# EAGLE schematic DF32-revision-Brouted (EAGLE 6.6.0)
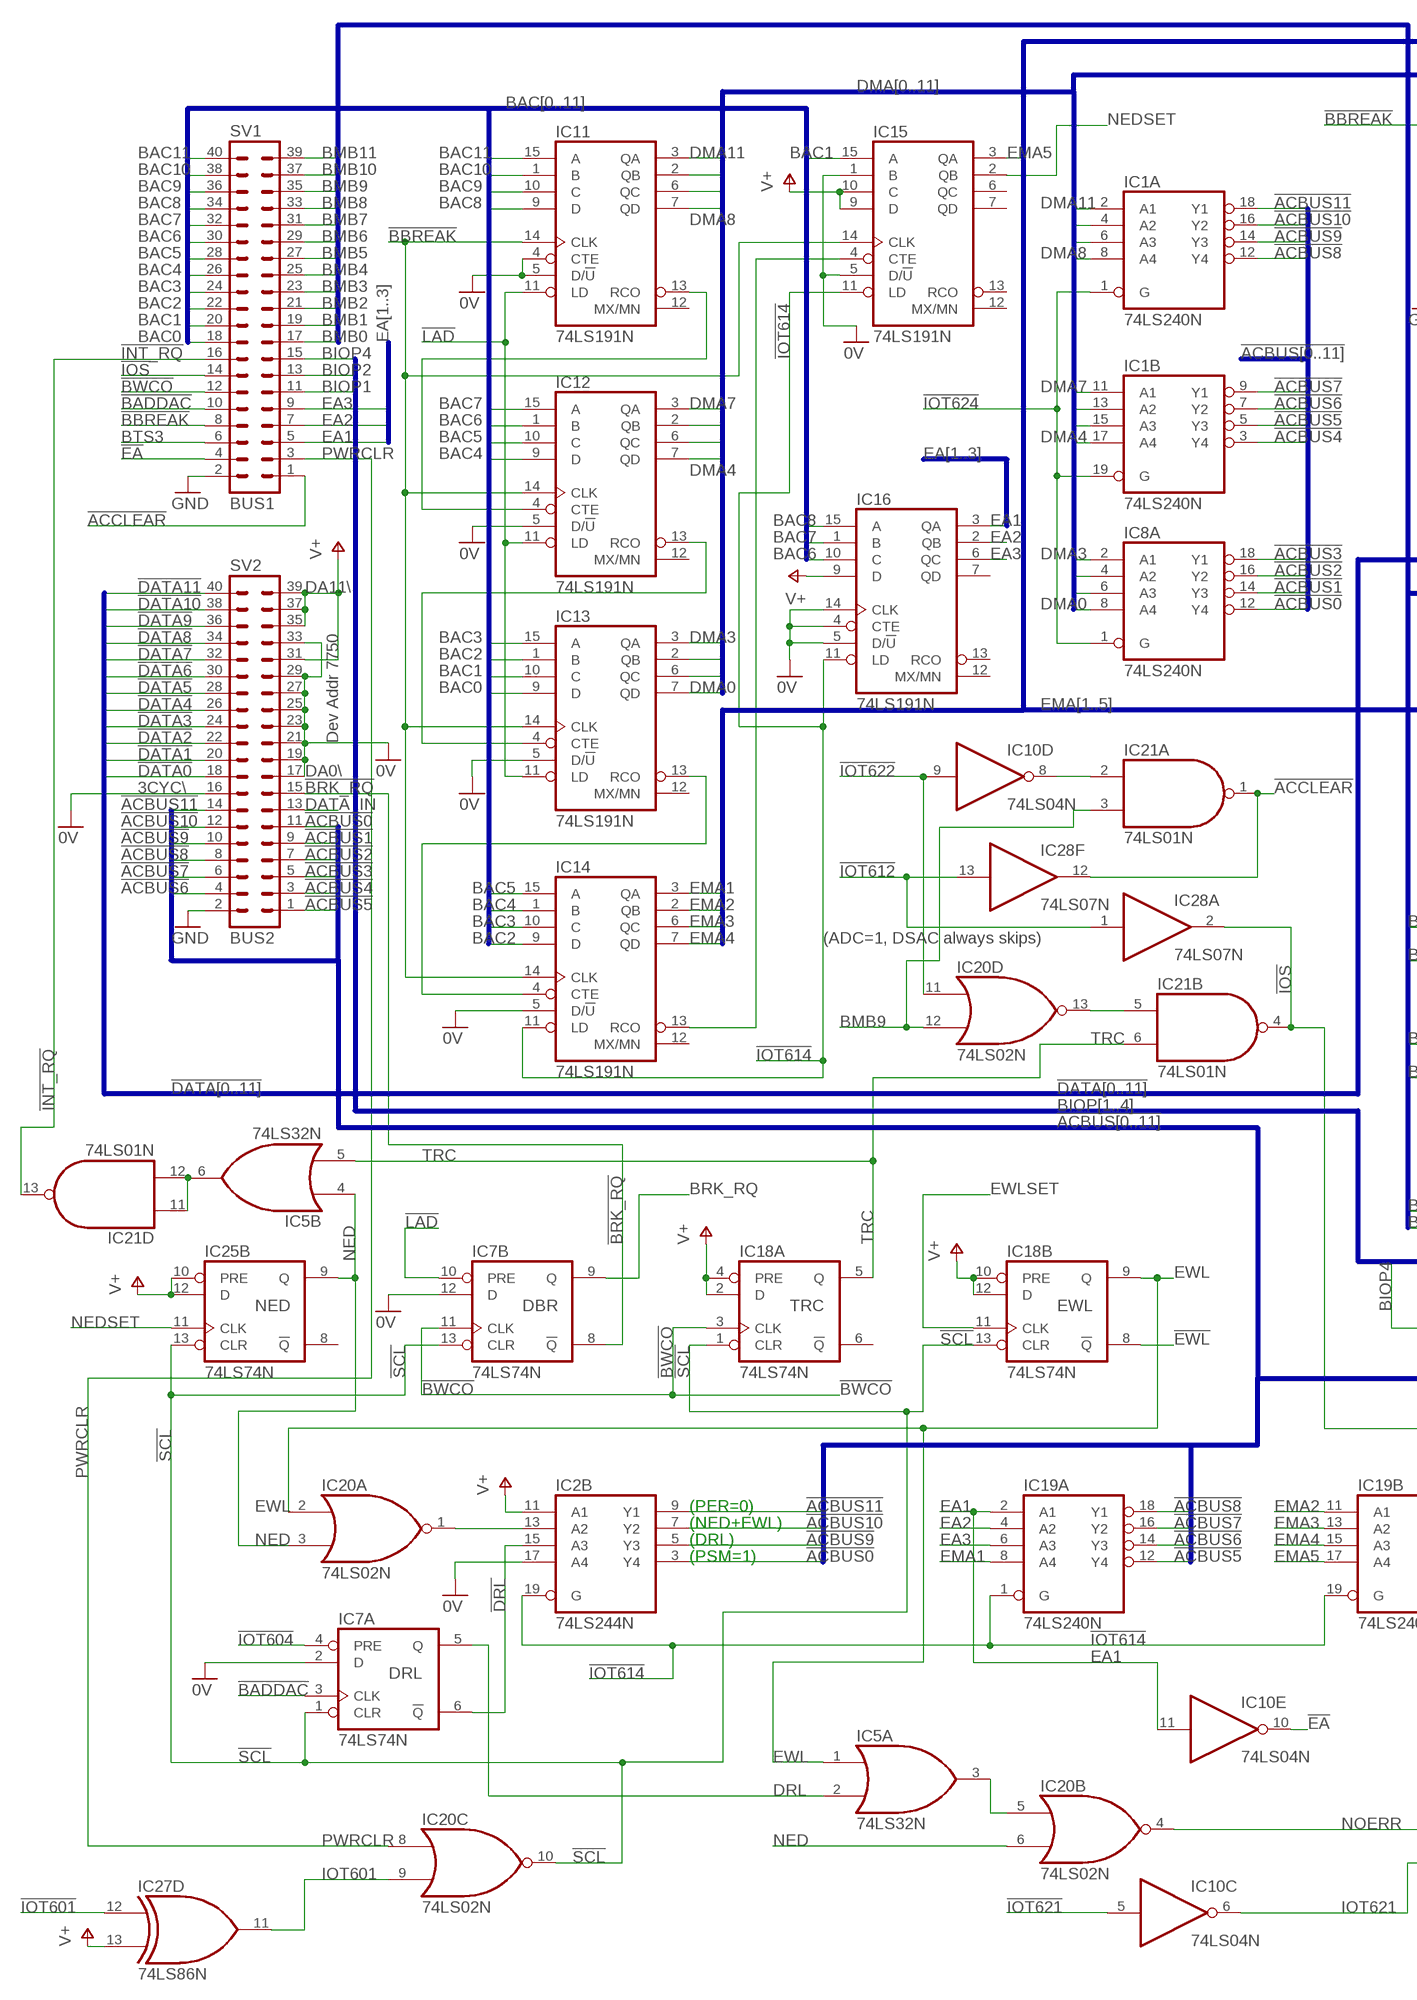
[diagram p0: schematic, sheet 1, part 1 of 2]
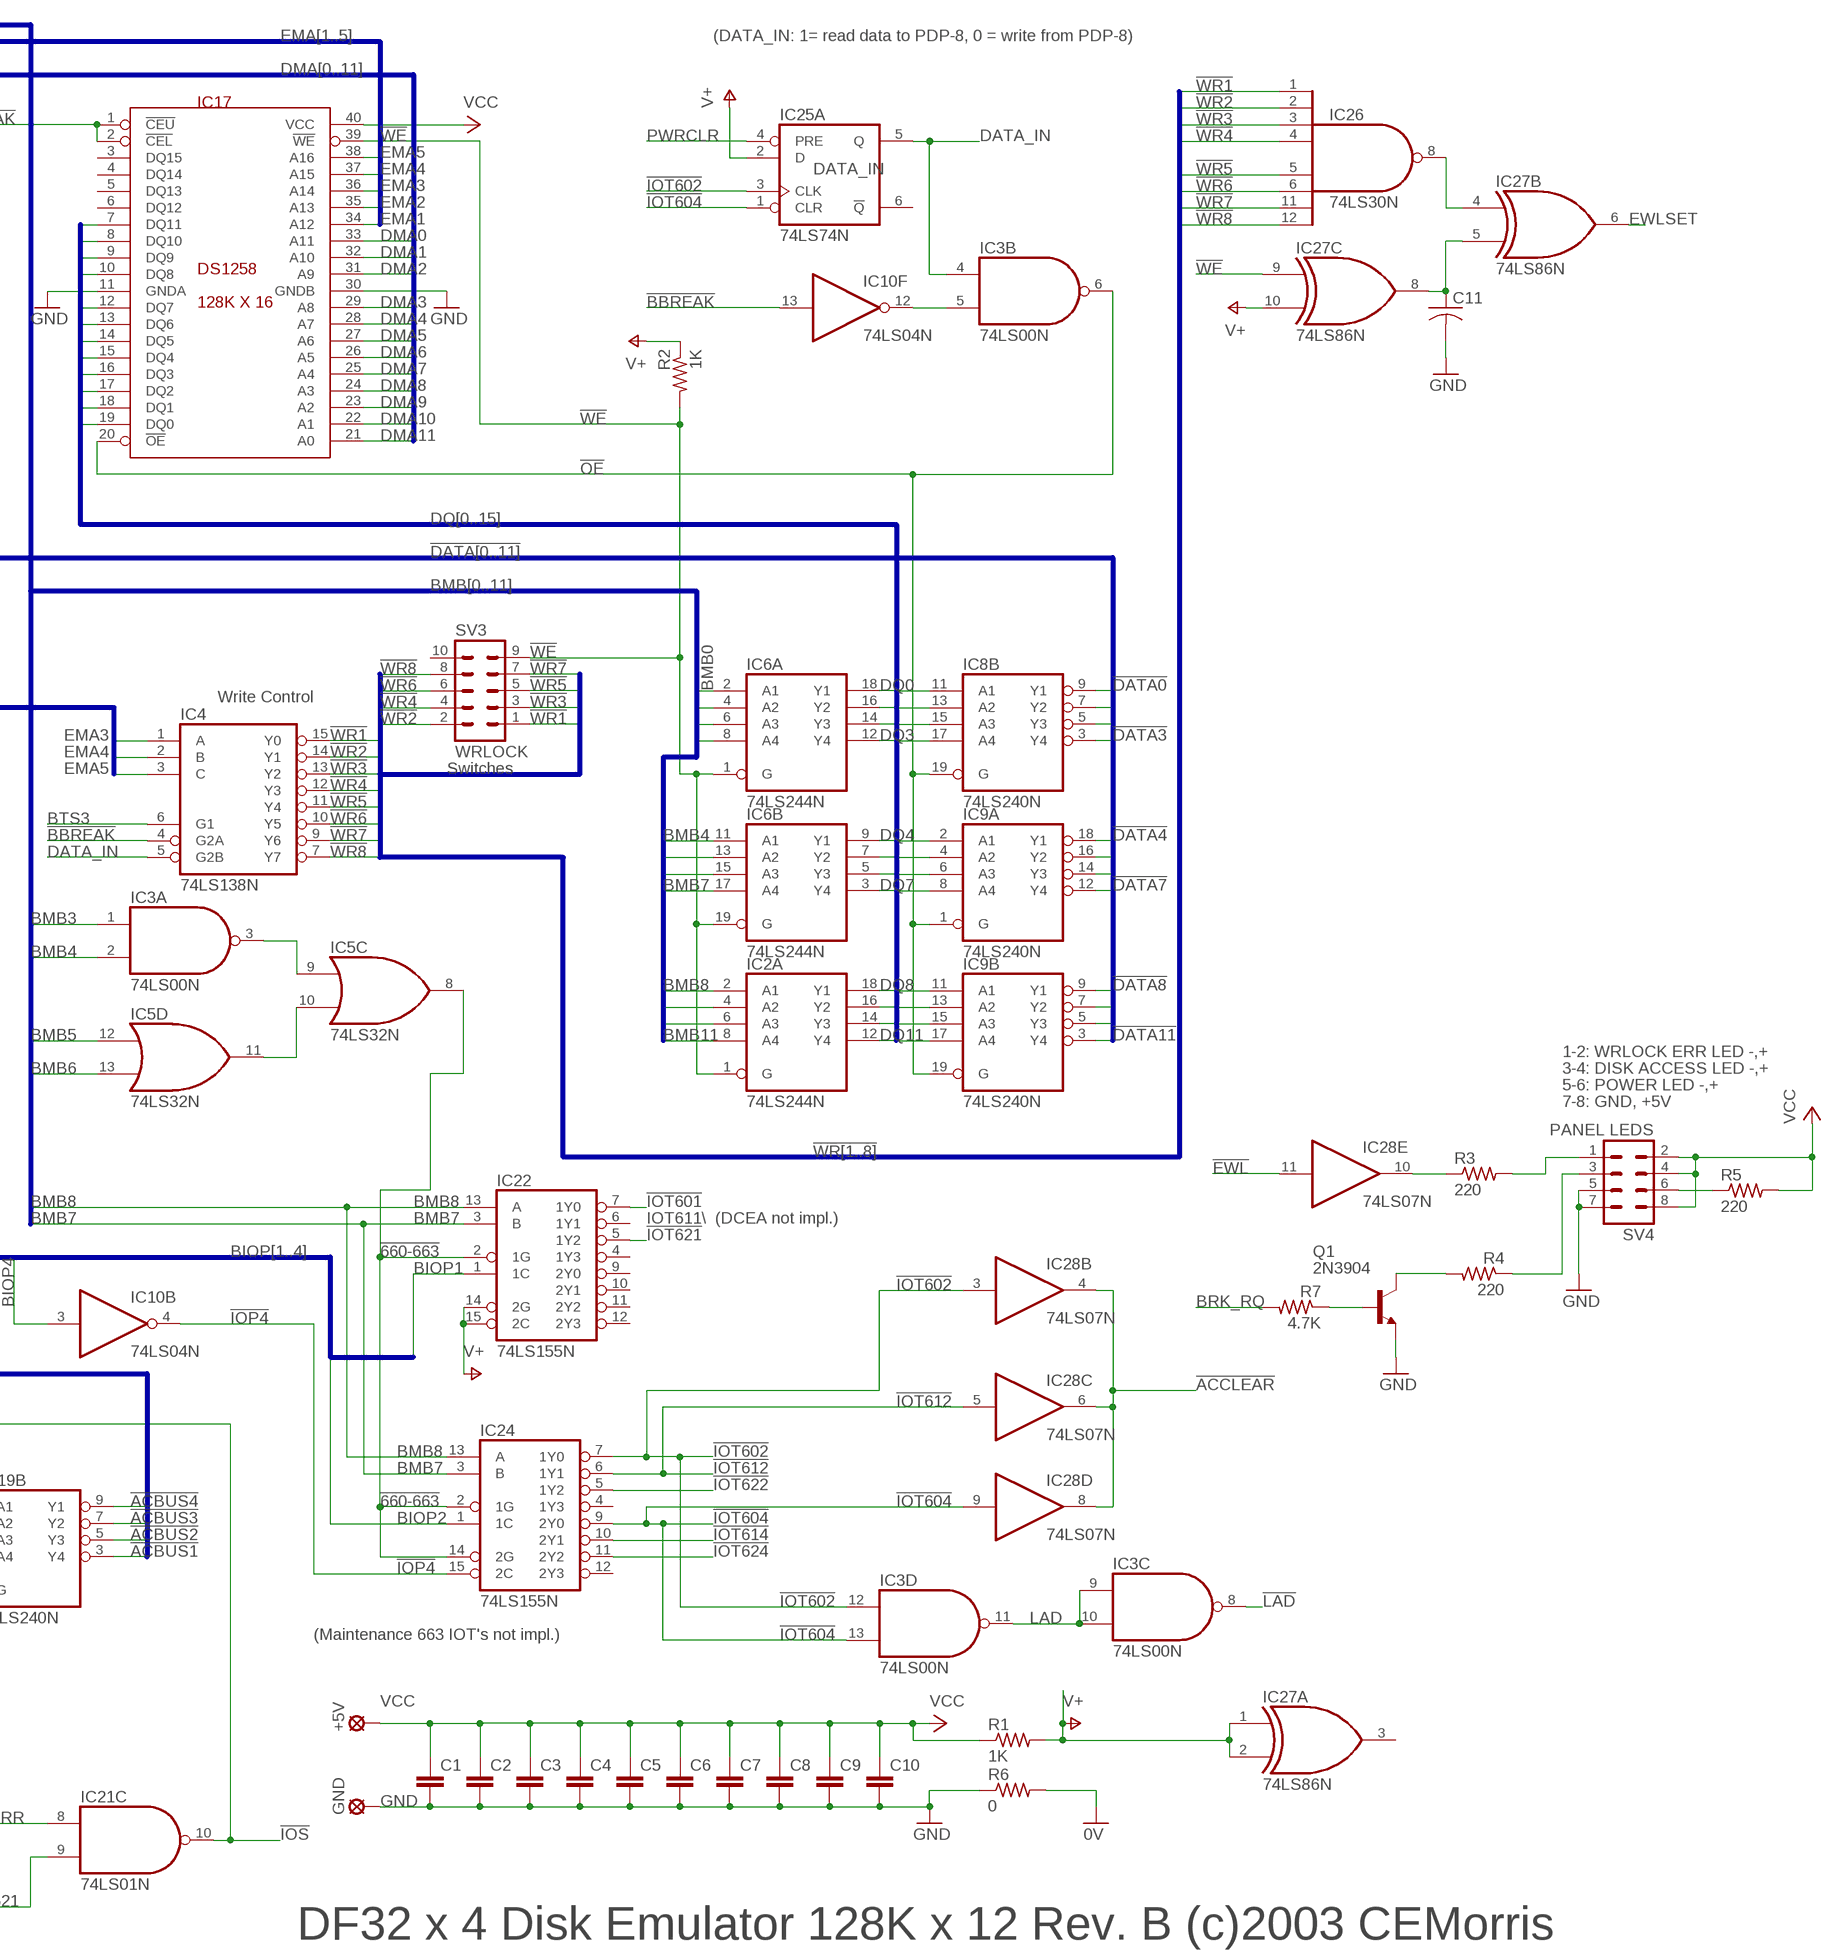
[diagram p1: schematic, sheet 1, part 2 of 2]

## Parts
+5V  SE14  [SE14]
C1  C5/3.5  [C5B3.5]
C2  C5/3.5  [C5B3.5]
C3  C5/3.5  [C5B3.5]
C4  C5/3.5  [C5B3.5]
C5  C5/3.5  [C5B3.5]
C6  C5/3.5  [C5B3.5]
C7  C5/3.5  [C5B3.5]
C8  C5/3.5  [C5B3.5]
C9  C5/3.5  [C5B3.5]
C10  C5/3.5  [C5B3.5]
C11  C-US025-025X050  [C025-025X050]
GND  SE14  [SE14]
IC1  74LS240N  [DIL20]
IC2  74LS244N  [DIL20]
IC3  74LS00N  [DIL14]
IC4  74LS138N  [DIL16]
IC5  74LS32N  [DIL14]
IC6  74LS244N  [DIL20]
IC7  74LS74N  [DIL14]
IC8  74LS240N  [DIL20]
IC9  74LS240N  [DIL20]
IC10  74LS04N  [DIL14]
IC11  74LS191N  74LS190N  [DIL16]
IC12  74LS191N  74LS190N  [DIL16]
IC13  74LS191N  74LS190N  [DIL16]
IC14  74LS191N  74LS190N  [DIL16]
IC15  74LS191N  74LS190N  [DIL16]
IC16  74LS191N  74LS190N  [DIL16]
IC17  DS1258  [DIL40]
IC18  74LS74N  [DIL14]
IC19  74LS240N  [DIL20]
IC20  74LS02N  [DIL14]
IC21  74LS01N  [DIL14]
IC22  74LS155N  [DIL16]
IC24  74LS155N  [DIL16]
IC25  74LS74N  [DIL14]
IC26  74LS30N  [DIL14]
IC27  74LS86N  [DIL14]
IC28  74LS07N  [DIL14]
Q1  2N3904  [TO92]
R1  1K  R-US_0204/5  [0204/5]
R2  1K  R-US_0204/7  [0204/7]
R3  220  R-US_0204/5  [0204/5]
R4  220  R-US_0204/5  [0204/5]
R5  220  R-US_0204/5  [0204/5]
R6  0  R-US_0204/5  [0204/5]
R7  4.7K  R-US_0204/5  [0204/5]
SV1  BUS1  MA20-2  [MA20-2]
SV2  BUS2  MA20-2  [MA20-2]
SV3  WRLOCK  MA05-2  [MA05-2]
SV4  PANEL LEDS  MA04-2  [MA04-2]

## Nets
0V: IC2.17(B:A4) IC7.2(A:D) IC7.12(B:D) IC11.4(CTE) IC11.5(D/!U) IC12.5(D/!U) IC13.5(D/!U) IC14.5(D/!U) IC15.1(B) IC15.5(D/!U) IC16.4(CTE) IC16.5(D/!U) IC16.14(CLK) R6.2 SV2.16 SV2.17 SV2.19 SV2.21 SV2.23 SV2.25 SV2.27 SV2.29 SV2.33
!660-663: IC5.8(C:O) IC22.2(1G) IC24.2(1G) IC24.14(2G)
!(NED+EWL): IC2.13(B:A2) IC20.1(A:O)
!ACBUS0: IC2.3(B:Y4) IC8.12(A:Y4) SV2.11
!ACBUS1: IC8.14(A:Y3) IC19.3(B:Y4) SV2.9
!ACBUS2: IC8.16(A:Y2) IC19.5(B:Y3) SV2.7
!ACBUS3: IC8.18(A:Y1) IC19.7(B:Y2) SV2.5
!ACBUS4: IC1.3(B:Y4) IC19.9(B:Y1) SV2.3
!ACBUS5: IC1.5(B:Y3) IC19.12(A:Y4) SV2.1
!ACBUS6: IC1.7(B:Y2) IC19.14(A:Y3) SV2.4
!ACBUS7: IC1.9(B:Y1) IC19.16(A:Y2) SV2.6
!ACBUS8: IC1.12(A:Y4) IC19.18(A:Y1) SV2.8
!ACBUS9: IC1.14(A:Y3) IC2.5(B:Y3) SV2.10
!ACBUS10: IC1.16(A:Y2) IC2.7(B:Y2) SV2.12
!ACBUS11: IC1.18(A:Y1) IC2.9(B:Y1) SV2.14
!ACCLEAR: IC21.1(A:O) IC28.4(B:O) IC28.6(C:O) IC28.8(D:O) IC28.12(F:O) SV1.1
!BADDAC: IC7.3(A:CLK) SV1.10
!BBREAK: IC4.4(G2A) IC10.13(F:I) IC11.14(CLK) IC12.14(CLK) IC13.14(CLK) IC14.14(CLK) IC15.14(CLK) IC17.1(!CEU) IC17.2(!CEL) SV1.8
!BRK_RQ: IC7.8(B:!Q) SV2.15
!BWCO: IC7.11(B:CLK) IC18.3(A:CLK) SV1.12
!DATA0: IC8.9(B:Y1) SV2.18
!DATA1: IC8.7(B:Y2) SV2.20
!DATA2: IC8.5(B:Y3) SV2.22
!DATA3: IC8.3(B:Y4) SV2.24
!DATA4: IC9.18(A:Y1) SV2.26
!DATA5: IC9.16(A:Y2) SV2.28
!DATA6: IC9.14(A:Y3) SV2.30
!DATA7: IC9.12(A:Y4) SV2.32
!DATA8: IC9.9(B:Y1) SV2.34
!DATA9: IC9.7(B:Y2) SV2.36
!DATA10: IC9.5(B:Y3) SV2.38
!DATA11: IC9.3(B:Y4) SV2.40
!DRL: IC2.15(B:A3) IC7.6(A:!Q)
!EA: IC10.10(E:O) SV1.4
!EWL: IC18.8(B:!Q) IC28.11(E:I)
!INT_RQ: IC21.13(D:O) SV1.16
!IOP4: IC10.4(B:O) IC24.15(2C)
!IOS: IC21.4(B:O) IC21.10(C:O) IC28.2(A:O) SV1.14
!IOT601: IC22.7(1Y0) IC27.12(D:I0)
!IOT602: IC3.12(D:I0) IC24.7(1Y0) IC25.3(A:CLK) IC28.3(B:I)
!IOT604: IC3.13(D:I1) IC7.4(A:PRE) IC24.9(2Y0) IC25.1(A:CLR) IC28.9(D:I)
!IOT612: IC24.6(1Y1) IC28.1(A:I) IC28.5(C:I) IC28.13(F:I)
!IOT614: IC2.19(B:G) IC14.11(LD) IC15.11(LD) IC16.11(LD) IC19.1(A:G) IC19.19(B:G) IC24.10(2Y1)
!IOT621: IC10.5(C:I) IC22.5(1Y2)
!IOT622: IC10.9(D:I) IC20.11(D:I0) IC24.5(1Y2)
!IOT624: IC1.1(A:G) IC1.19(B:G) IC8.1(A:G) IC24.11(2Y2)
!LAD: IC3.8(C:O) IC7.10(B:PRE) IC11.11(LD) IC12.11(LD) IC13.11(LD)
!OE: IC3.6(B:O) IC8.19(B:G) IC9.1(A:G) IC9.19(B:G) IC17.20(!OE)
!SCL: IC7.1(A:CLR) IC7.13(B:CLR) IC18.1(A:CLR) IC18.13(B:CLR) IC20.10(C:O) IC25.13(B:CLR)
!WE: IC2.1(A:G) IC6.1(A:G) IC6.19(B:G) IC17.39(!WE) IC27.9(C:I0) R2.2 SV3.9
!WR1: IC4.15(Y0) IC26.1(I0) SV3.1
!WR2: IC4.14(Y1) IC26.2(I1) SV3.2
!WR3: IC4.13(Y2) IC26.3(I2) SV3.3
!WR4: IC4.12(Y3) IC26.4(I3) SV3.4
!WR5: IC4.11(Y4) IC26.5(I4) SV3.5
!WR6: IC4.10(Y5) IC26.6(I5) SV3.6
!WR7: IC4.9(Y6) IC26.11(I6) SV3.7
!WR8: IC4.7(Y7) IC26.12(I7) SV3.8
BAC0: IC13.9(D) SV1.18
BAC1: IC13.10(C) IC15.15(A) SV1.20
BAC2: IC13.1(B) IC14.9(D) SV1.22
BAC3: IC13.15(A) IC14.10(C) SV1.24
BAC4: IC12.9(D) IC14.1(B) SV1.26
BAC5: IC12.10(C) IC14.15(A) SV1.28
BAC6: IC12.1(B) IC16.10(C) SV1.30
BAC7: IC12.15(A) IC16.1(B) SV1.32
BAC8: IC11.9(D) IC16.15(A) SV1.34
BAC9: IC11.10(C) SV1.36
BAC10: IC11.1(B) SV1.38
BAC11: IC11.15(A) SV1.40
BIOP1: IC22.1(1C) SV1.11
BIOP2: IC24.1(1C) SV1.13
BIOP4: IC10.3(B:I) SV1.15
BMB0: IC6.2(A:A1) SV1.17
BMB1: IC6.4(A:A2) SV1.19
BMB2: IC6.6(A:A3) SV1.21
BMB3: IC3.1(A:I0) IC6.8(A:A4) SV1.23
BMB4: IC3.2(A:I1) IC6.11(B:A1) SV1.25
BMB5: IC5.12(D:I0) IC6.13(B:A2) SV1.27
BMB6: IC5.13(D:I1) IC6.15(B:A3) SV1.29
BMB7: IC6.17(B:A4) IC22.3(B) IC24.3(B) SV1.31
BMB8: IC2.2(A:A1) IC22.13(A) IC24.13(A) SV1.33
BMB9: IC2.4(A:A2) IC20.12(D:I1) IC21.3(A:I1) SV1.35
BMB10: IC2.6(A:A3) SV1.37
BMB11: IC2.8(A:A4) SV1.39
BRK_RQ: IC7.9(B:Q) R7.2
BTS3: IC4.6(G1) SV1.6
DATA_IN: IC3.4(B:I0) IC4.5(G2B) IC25.5(A:Q) SV2.13
DISK_LED: R4.1 SV4.3
DMA0: IC8.8(A:A4) IC13.7(QD) IC17.33(A11)
DMA1: IC8.6(A:A3) IC13.6(QC) IC17.32(A10)
DMA2: IC8.4(A:A2) IC13.2(QB) IC17.31(A9)
DMA3: IC8.2(A:A1) IC13.3(QA) IC17.29(A8)
DMA4: IC1.17(B:A4) IC12.7(QD) IC17.28(A7)
DMA5: IC1.15(B:A3) IC12.6(QC) IC17.27(A6)
DMA6: IC1.13(B:A2) IC12.2(QB) IC17.26(A5)
DMA7: IC1.11(B:A1) IC12.3(QA) IC17.25(A4)
DMA8: IC1.8(A:A4) IC11.7(QD) IC17.24(A3)
DMA9: IC1.6(A:A3) IC11.6(QC) IC17.23(A2)
DMA10: IC1.4(A:A2) IC11.2(QB) IC17.22(A1)
DMA11: IC1.2(A:A1) IC11.3(QA) IC17.21(A0)
DQ0: IC6.18(A:Y1) IC8.11(B:A1) IC17.19(DQ0)
DQ1: IC6.16(A:Y2) IC8.13(B:A2) IC17.18(DQ1)
DQ2: IC6.14(A:Y3) IC8.15(B:A3) IC17.17(DQ2)
DQ3: IC6.12(A:Y4) IC8.17(B:A4) IC17.16(DQ3)
DQ4: IC6.9(B:Y1) IC9.2(A:A1) IC17.15(DQ4)
DQ5: IC6.7(B:Y2) IC9.4(A:A2) IC17.14(DQ5)
DQ6: IC6.5(B:Y3) IC9.6(A:A3) IC17.13(DQ6)
DQ7: IC6.3(B:Y4) IC9.8(A:A4) IC17.12(DQ7)
DQ8: IC2.18(A:Y1) IC9.11(B:A1) IC17.10(DQ8)
DQ9: IC2.16(A:Y2) IC9.13(B:A2) IC17.9(DQ9)
DQ10: IC2.14(A:Y3) IC9.15(B:A3) IC17.8(DQ10)
DQ11: IC2.12(A:Y4) IC9.17(B:A4) IC17.7(DQ11)
DRL: IC5.2(A:I1) IC7.5(A:Q)
EA1: IC10.11(E:I) IC16.3(QA) IC19.2(A:A1) SV1.5
EA2: IC16.2(QB) IC19.4(A:A2) SV1.7
EA3: IC16.6(QC) IC19.6(A:A3) SV1.9
EMA1: IC14.3(QA) IC17.34(A12) IC19.8(A:A4)
EMA2: IC14.2(QB) IC17.35(A13) IC19.11(B:A1)
EMA3: IC4.1(A) IC14.6(QC) IC17.36(A14) IC19.13(B:A2)
EMA4: IC4.2(B) IC14.7(QD) IC17.37(A15) IC19.15(B:A3)
EMA5: IC4.3(C) IC15.3(QA) IC17.38(A16) IC19.17(B:A4)
EWL: IC5.1(A:I0) IC18.9(B:Q) IC20.2(A:I0)
EWLSET: IC18.11(B:CLK) IC27.6(B:O)
GND [supply]: C1.2 C2.2 C3.2 C4.2 C5.2 C6.2 C7.2 C8.2 C9.2 C10.2 C11.2 GND.MP IC17.11(GNDA) IC17.30(GNDB) Q1.3(E) R6.1 SV1.2 SV2.2 SV4.5 SV4.7
IOT601: IC20.9(C:I1) IC27.11(D:O)
IOT621: IC10.6(C:O) IC21.9(C:I1)
LAD: IC3.9(C:I0) IC3.10(C:I1) IC3.11(D:O)
N$1: C11.1 IC27.5(B:I1) IC27.8(C:O)
N$2: IC5.6(B:O) IC21.11(D:I0) IC21.12(D:I1)
N$3: IC28.10(E:O) R3.1
N$4: IC3.5(B:I1) IC10.12(F:O)
N$5: Q1.1(C) R4.2
N$6: R5.1 SV4.6
N$10: IC13.13(RCO) IC14.4(CTE)
N$11: IC12.13(RCO) IC13.4(CTE)
N$12: IC11.13(RCO) IC12.4(CTE)
N$13: IC3.3(A:O) IC5.9(C:I0)
N$14: IC14.13(RCO) IC15.4(CTE)
N$15: IC5.10(C:I1) IC5.11(D:O)
N$17: IC20.13(D:O) IC21.5(B:I0)
N$19: IC5.3(A:O) IC20.5(B:I0)
N$21: IC10.8(D:O) IC21.2(A:I0)
N$22: IC26.8(O) IC27.4(B:I0)
N$23: Q1.2(B) R7.1
NED: IC5.4(B:I0) IC20.3(A:I1) IC20.6(B:I1) IC25.9(B:Q)
NEDSET: IC15.2(QB) IC25.11(B:CLK)
NOERR: IC20.4(B:O) IC21.8(C:I0)
PWRCLR: IC20.8(C:I0) IC25.4(A:PRE) SV1.3
TRC: IC5.5(B:I1) IC18.5(A:Q) IC21.6(B:I1)
V+: IC2.11(B:A1) IC15.9(D) IC15.10(C) IC16.9(D) IC18.2(A:D) IC18.4(A:PRE) IC18.10(B:PRE) IC18.12(B:D) IC22.14(2G) IC22.15(2C) IC25.2(A:D) IC25.10(B:PRE) IC25.12(B:D) IC27.1(A:I0) IC27.2(A:I1) IC27.10(C:I1) IC27.13(D:I1) R1.2 R2.1 SV2.31 SV2.35 SV2.37 SV2.39
VCC [supply]: +5V.MP C1.1 C2.1 C3.1 C4.1 C5.1 C6.1 C7.1 C8.1 C9.1 C10.1 IC17.40(VCC) R1.1 R5.2 SV4.2 SV4.4 SV4.8
WRITELOCK_LED: R3.2 SV4.1
Unconnected: IC10.1(A:I) IC10.2(A:O) IC11.12(MX/MN) IC12.12(MX/MN) IC13.12(MX/MN) IC14.12(MX/MN) IC15.6(QC) IC15.7(QD) IC15.12(MX/MN) IC15.13(RCO) IC16.7(QD) IC16.12(MX/MN) IC16.13(RCO) IC17.3(DQ15) IC17.4(DQ14) IC17.5(DQ13) IC17.6(DQ12) IC18.6(A:!Q) IC22.4(1Y3) IC22.6(1Y1) IC22.9(2Y0) IC22.10(2Y1) IC22.11(2Y2) IC22.12(2Y3) IC24.4(1Y3) IC24.12(2Y3) IC25.6(A:!Q) IC25.8(B:!Q) IC27.3(A:O) SV3.10

## Buses
BAC[0..11]
!DATA[0..11]
DMA[0..11]
EMA[1..5]
BMB[0..11]
EMA[3..5]
DQ[0..15]
BIOP[1..4]
!ACBUS[0..11]
EA[1..3]
!WR[1..8]

## Notes on the sheet
- (DATA_IN: 1= read data to PDP-8, 0 = write from PDP-8)
- DATA_IN
- DA11\\
- Write Control
- Dev Addr 7750
- DA0\\ | Switches
- 3CYC\\
- (ADC=1, DSAC always skips)
- 1-2: WRLOCK ERR LED -,+
- 3-4: DISK ACCESS LED -,+
- 5-6: POWER LED -,+
- 7-8: GND, +5V
- IOT611\\  (DCEA not impl.)
- NED | DBR | TRC | EWL
- (PER=0)
- (NED+EWL)
- (DRL)
- (PSM=1)
- (Maintenance 663 IOT's not impl.)
- DRL
- DF32 x 4 Disk Emulator 128K x 12 Rev. B (c)2003 CEMorris

## Power pins joined to a net without a drawn wire
GND: IC1.10(P:GND) IC2.10(P:GND) IC3.7(P:GND) IC4.8(GND) IC5.7(P:GND) IC6.10(P:GND) IC7.7(P:GND) IC8.10(P:GND) IC9.10(P:GND) IC10.7(P:GND) IC11.8(GND) IC12.8(GND) IC13.8(GND) IC14.8(GND) IC15.8(GND) IC16.8(GND) IC18.7(P:GND) IC19.10(P:GND) IC20.7(P:GND) IC21.7(P:GND) IC22.8(GND) IC24.8(GND) IC25.7(P:GND) IC26.7(GND) IC27.7(P:GND) IC28.7(P:GND)
VCC: IC1.20(P:VCC) IC2.20(P:VCC) IC3.14(P:VCC) IC4.16(VCC) IC5.14(P:VCC) IC6.20(P:VCC) IC7.14(P:VCC) IC8.20(P:VCC) IC9.20(P:VCC) IC10.14(P:VCC) IC11.16(VCC) IC12.16(VCC) IC13.16(VCC) IC14.16(VCC) IC15.16(VCC) IC16.16(VCC) IC18.14(P:VCC) IC19.20(P:VCC) IC20.14(P:VCC) IC21.14(P:VCC) IC22.16(VCC) IC24.16(VCC) IC25.14(P:VCC) IC26.14(VCC) IC27.14(P:VCC) IC28.14(P:VCC)

## Library data of the parts
+5V GND = solpad:SE14: SOLDER PAD E1553, drill 1,4mm, distributor Buerklin, 07F820
C1-C10 = capacitor-wima:C: CAPACITOR naming: grid - package width
C11 = rcl:C-US: CAPACITOR, American symbol
IC1 IC8 IC9 IC19 = 74xx-us:74*240: Octal BUFFER and LINE DRIVER, 3-state
IC2 IC6 = 74xx-us:74*244: Octal BUFFER and LINE DRIVER, 3-state
IC3 = 74xx-us:74*00: Quad 2-input NAND gate
IC4 = 74xx-us:74*138: 3-line to 8-line DECODER/DEMULTIPLEXER
IC5 = 74xx-us:74*32: Quad 2-input OR gate
IC7 IC18 IC25 = 74xx-us:74*74: Dual D type positive edge triggered FLIP FLOP, preset and clear
IC10 = 74xx-us:74*04: Hex INVERTER
IC11-IC16 = 74xx-us:74*190: Synchronous UP/DOWN COUNTER
IC17 = maxim:DS1258: DS1258 128K x 16 NVRAM
IC20 = 74xx-us:74*02: Quad 2-input NOR gate
IC21 = 74xx-us:74*01: Quad 2-input NAND gate, open collector
IC22 IC24 = 74xx-us:74*155: Dual 2-line to 4-line data DECODER/DEMULTIPLEXER
IC26 = 74xx-us:74*30: 8-input NAND gate
IC27 = 74xx-us:74*86: Quad 2-input EXCLUSIV-OR (XOR) gate
IC28 = 74xx-us:74*07: Hex BUFFER, open collector high-voltage output
Q1 = transistor-npn:2N3904: NPN Transistor
R1-R7 = rcl:R-US_: RESISTOR, American symbol
SV1 SV2 = con-lstb:MA20-2: PIN HEADER; OC_FARNELL: unknown; OC_NEWARK: unknown
SV3 = con-lstb:MA05-2: PIN HEADER; OC_FARNELL: unknown; OC_NEWARK: unknown
SV4 = con-lstb:MA04-2: PIN HEADER; OC_FARNELL: unknown; OC_NEWARK: unknown

## Net classes
1 supply: width 1.016 mm